# EAGLE design LTE Shield v2 (EAGLE 8.4.2)
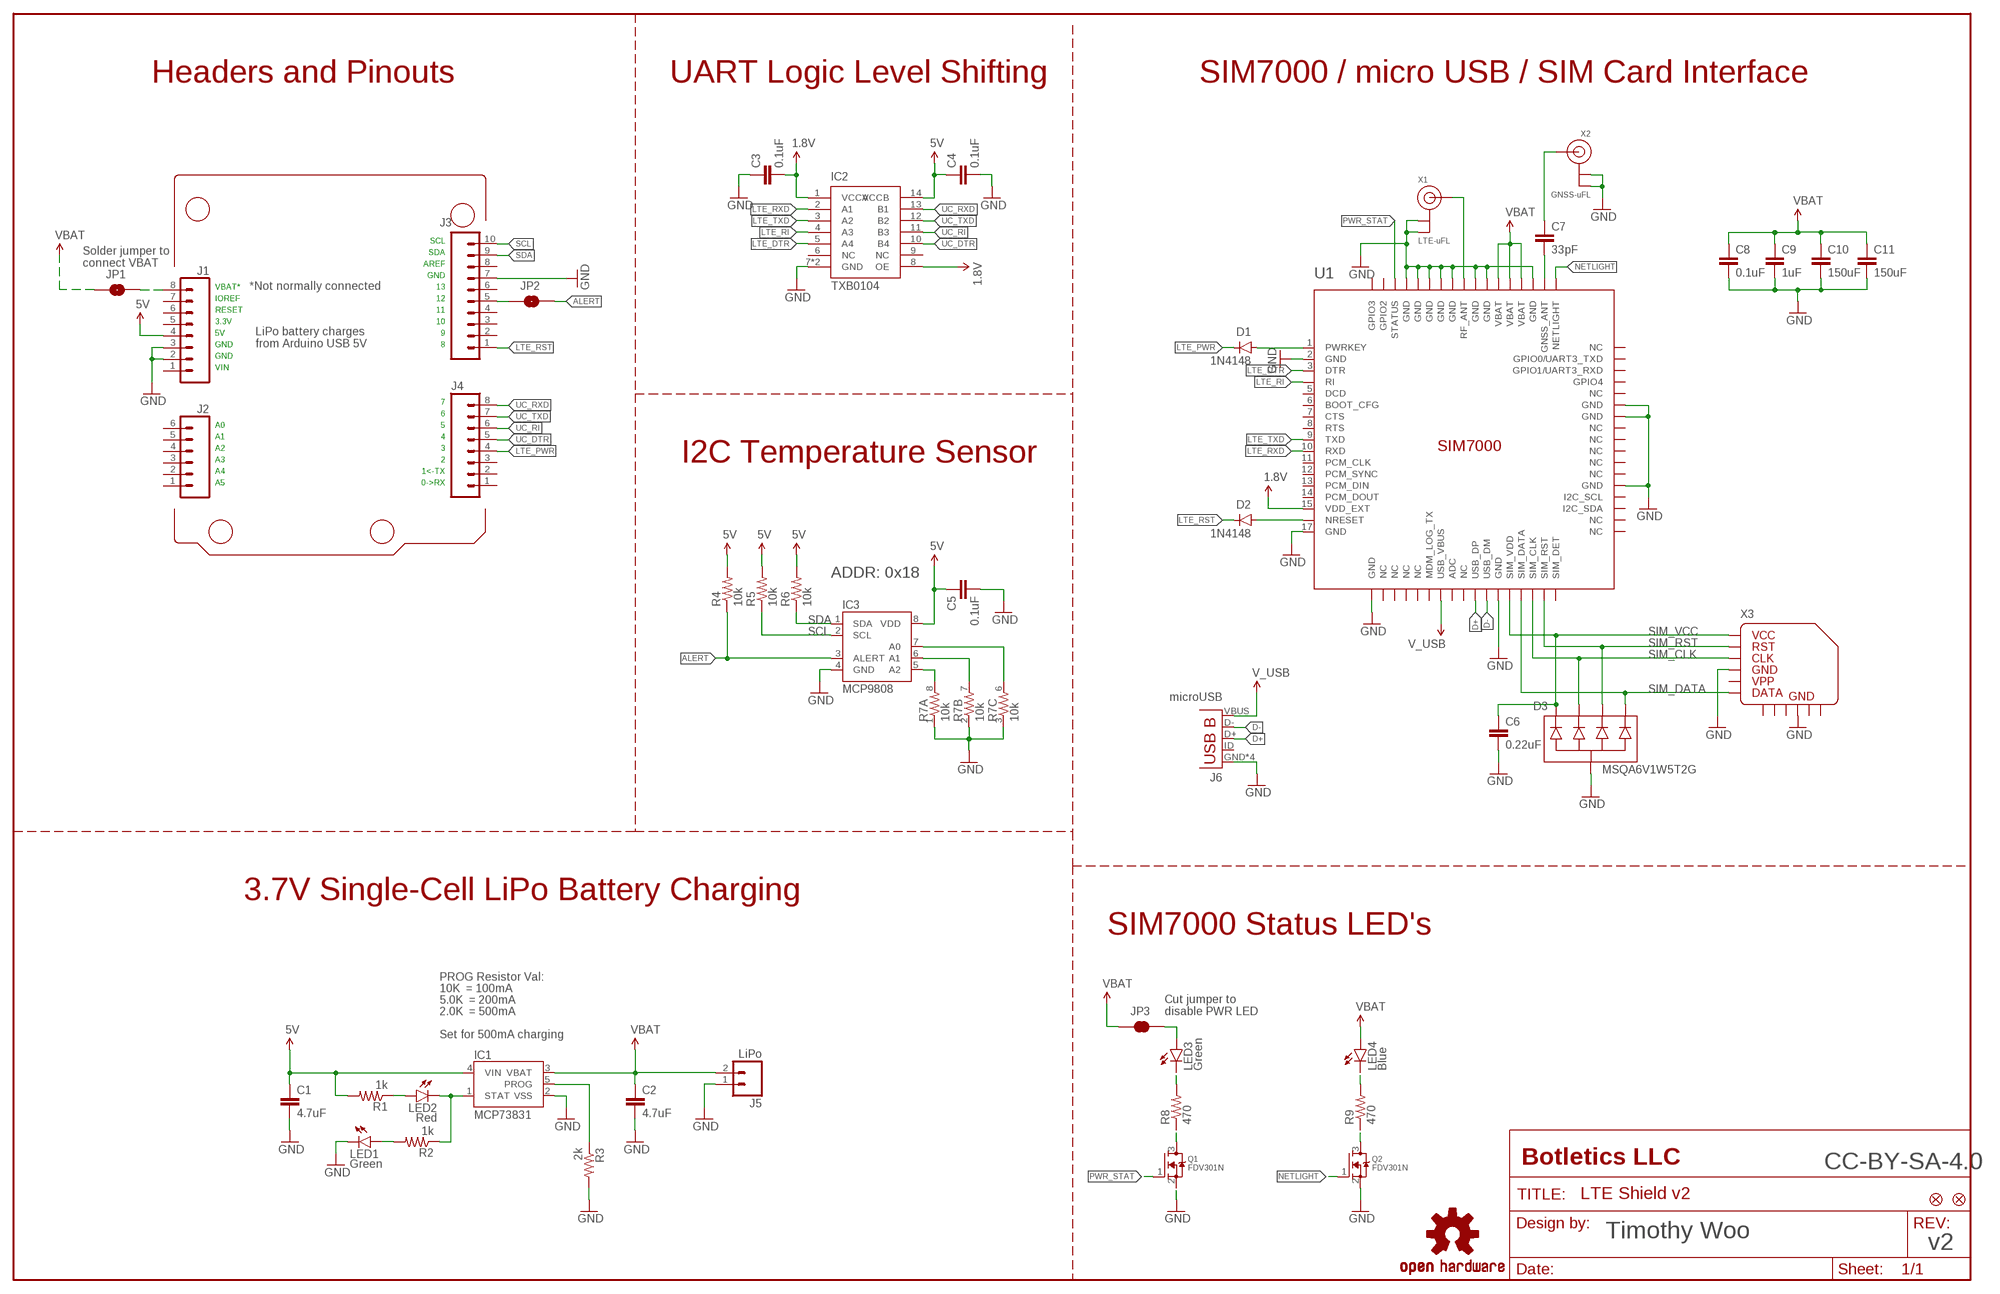
[diagram p0: schematic, sheet 1]

## Parts
C1  4.7uF  CAPMARKED-0603  [0603-CAP-MARKED]
C2  4.7uF  CAPMARKED-0603  [0603-CAP-MARKED]
C3  0.1uF  CAPMARKED-0603  [0603-CAP-MARKED]
C4  0.1uF  CAPMARKED-0603  [0603-CAP-MARKED]
C5  0.1uF  CAPMARKED-0603  [0603-CAP-MARKED]
C6  0.22uF  CAPMARKED-0603  [0603-CAP-MARKED]
C7  33pF  CAPMARKED-0603  [0603-CAP-MARKED]
C8  0.1uF  CAPMARKED-0603  [0603-CAP-MARKED]
C9  1uF  CAPMARKED-0603  [0603-CAP-MARKED]
C10  150uF  CAP1206  [1206]
C11  150uF  CAP1206  [1206]
D1  1N4148  DIODESOD323  [SOD-323]
D2  1N4148  DIODESOD323  [SOD-323]
D3  MSQA6V1W5T2G  TVS-DIODE-ARRAY-4X  [SOT-353]
FID1  FIDUCIAL  [FIDUCIAL_1MM]
FID2  FIDUCIAL  [FIDUCIAL_1MM]
IC1  MCP73831  [SOT23-5]
IC2  TXB0104  LEVEL_SHIFTER_TXB0104TXB0104RGYR  [VQFN-14]
IC3  MCP9808  MCP9808-MSOP  [8-TSSOP]
J1  M08SILK_PTH  [1X08]
J2  M06SILK_PTH  [1X06]
J3  M10SILK_PTH  [1X10]
J4  M08SILK_PTH  [1X08]
J5  LiPo  M02-JST-2MM-SMT  [JST-2-SMD]
J6  microUSB  MICRO-USB_SMD_NOSHIELDV1  [USB-B-MICRO-SMD]
JP1  JUMPER-SMT_2_NO_SILK  [SMT-JUMPER_2_NO_SILK]
JP2  JUMPER-SMT_2_NO_SILK  [SMT-JUMPER_2_NO_SILK]
JP3  JUMPER-SMT_2_NC_TRACE_SILK  [SMT-JUMPER_2_NC_TRACE_SILK]
LED1  Green  LED0603-MARKED  [LED-0603-MARKED]
LED2  Red  LED0603-MARKED  [LED-0603-MARKED]
LED3  Green  LED0603-MARKED  [LED-0603-MARKED]
LED4  Blue  LED0603-MARKED  [LED-0603-MARKED]
LOGO1  OSHW-LOGOL  [OSHW-LOGO-L]
Q1  FDV301N  MOSFET-NGENERIC  [SOT23-3]
Q2  FDV301N  MOSFET-NGENERIC  [SOT23-3]
R1  1k  RESISTORMARKED-0603  [0603-RES-MARKED]
R2  1k  RESISTORMARKED-0603  [0603-RES-MARKED]
R3  2k  RESISTORMARKED-0603  [0603-RES-MARKED]
R4  10k  RESISTORMARKED-0603  [0603-RES-MARKED]
R5  10k  RESISTORMARKED-0603  [0603-RES-MARKED]
R6  10k  RESISTORMARKED-0603  [0603-RES-MARKED]
R7  10k  RESISTOR_ARRAY_4X0603-ARV  [RES_ARRAY_4X0603]
R8  470  RESISTORMARKED-0603  [0603-RES-MARKED]
R9  470  RESISTORMARKED-0603  [0603-RES-MARKED]
U1  SIM7000  [SIM7000]
X1  LTE-uFL  ANTENNA_U.FL  [U.FL]
X2  GNSS-uFL  ANTENNA_U.FL  [U.FL]
X3  MICROSIM_SOCKET_PUSH-PULL  [MICROSIM_SOCKET_PUSH-PULL]

## Nets
1.8V: C3.2 IC2.1(VCCA) IC2.8(OE) U1.15(VDD_EXT)
5V: C1.1 C4.1 C5.1 IC1.4(VIN) IC2.14(VCCB) IC3.8(VDD) J1.4 R1.2 R4.2 R5.2 R6.2
ADDR0: IC3.7(A0) R7.6
ADDR1: IC3.6(A1) R7.7
ADDR2: IC3.5(A2) R7.8
ALERT: IC3.3(ALERT) JP2.2 R4.1
D+: J6.D+ U1.27(USB_DP)
D-: J6.D- U1.28(USB_DM)
GND: C1.2 C2.2 C3.1 C4.2 C5.2 C6.2 C8.2 C9.2 C10.2 C11.2 D3.2(COM) IC1.2(VSS) IC2.7(GND) IC2.PAD(GND) IC3.4(GND) J1.2 J1.3 J3.7 J5.1 J6.GND J6.SHIELD1(GND) J6.SHIELD2(GND) J6.SHIELD3(GND) LED1.C Q1.2(S) Q2.2(S) R3.2 R7.1 R7.2 R7.3 U1.2(GND) U1.17(GND) U1.18(GND) U1.29(GND) U1.39(GND) U1.45(GND) U1.46(GND) U1.54(GND) U1.58(GND) U1.59(GND) U1.61(GND) U1.62(GND) U1.63(GND) U1.64(GND) U1.65(GND) X1.1(GND) X1.2(GND) X2.1(GND) X2.2(GND) X3.C5 X3.GND@4(GND)
LTE_DTR: IC2.5(A4) U1.3(DTR)
LTE_PWR: D1.C J4.4
LTE_RI: IC2.4(A3) U1.4(RI)
LTE_RST: D2.C J3.1
LTE_RXD: IC2.2(A1) U1.10(RXD)
LTE_TXD: IC2.3(A2) U1.9(TXD)
N$1: C7.2 U1.53(GNSS_ANT)
N$2: D1.A U1.1(PWRKEY)
N$3: C7.1 X2.3(SIGNAL)
N$4: Q1.3(D) R8.1
N$5: LED3.C R8.2
N$6: LED2.A R1.1
N$7: J3.5 JP2.1
N$8: LED1.A R2.2
N$9: J1.8 JP1.2
N$10: Q2.3(D) R9.1
N$11: LED4.C R9.2
N$12: JP3.2 LED3.A
NETLIGHT: Q2.1(G) U1.52(NETLIGHT)
NRESET: D2.A U1.16(NRESET)
PROG: IC1.5(PROG) R3.1
PWR_STAT: Q1.1(G) U1.66(STATUS)
RF_ANT: U1.60(RF_ANT) X1.3(SIGNAL)
SCL: IC3.2(SCL) J3.10 R5.1
SDA: IC3.1(SDA) J3.9 R6.1
SIM_CLK: D3.3 U1.32(SIM_CLK) X3.C3
SIM_DATA: D3.5 U1.31(SIM_DATA) X3.C7
SIM_RST: D3.4 U1.33(SIM_RST) X3.C2
SIM_VCC: C6.1 D3.1 U1.30(SIM_VDD) X3.C1
STAT: IC1.1(STAT) LED2.C R2.1
UC_DTR: IC2.10(B4) J4.5
UC_RI: IC2.11(B3) J4.6
UC_RXD: IC2.13(B1) J4.8
UC_TXD: IC2.12(B2) J4.7
V_USB: J6.VBUS U1.24(USB_VBUS)
VBAT: C2.1 C8.1 C9.1 C10.1 C11.1 IC1.3(VBAT) J5.2 JP1.1 JP3.1 LED4.A U1.55(VBAT) U1.56(VBAT) U1.57(VBAT)
Unconnected: IC2.6(NC) IC2.9(NC) J1.1 J1.5 J1.6 J1.7 J2.1 J2.2 J2.3 J2.4 J2.5 J2.6 J3.2 J3.3 J3.4 J3.6 J3.8 J4.1 J4.2 J4.3 J6.ID(USBID) R7.4 R7.5 U1.5(DCD) U1.6(BOOT_CFG) U1.7(CTS) U1.8(RTS) U1.11(PCM_CLK) U1.12(PCM_SYNC) U1.13(PCM_DIN) U1.14(PCM_DOUT) U1.19(NC) U1.20(NC) U1.21(NC) U1.22(NC) U1.23(MDM_LOG_TX) U1.25(ADC) U1.26(NC) U1.34(SIM_DET) U1.35(NC) U1.36(NC) U1.37(I2C_SDA) U1.38(I2C_SCL) U1.40(NC) U1.41(NC) U1.42(NC) U1.43(NC) U1.44(NC) U1.47(NC) U1.48(GPIO4) U1.49(GPIO1/UART3_RXD) U1.50(GPIO0/UART3_TXD) U1.51(NC) U1.67(GPIO2) U1.68(GPIO3) X3.C6

## Notes on the sheet
- Headers and Pinouts | UART Logic Level Shifting | SIM7000 / micro USB / SIM Card Interface
- SCL
- SDA
- Solder jumper to
  connect VBAT
- AREF
- GND
- VBAT* | *Not normally connected | 13
- IOREF | 12
- RESET | 11
- 3.3V | 10
- 5V | 9
- GND
- LiPo battery charges
  from Arduino USB 5V
- 8
- GND
- VIN
- 7
- 6
- A0 | 5
- A1 | 4
- A2 | 3
- A3 | 2 | I2C Temperature Sensor
- A4 | 1<-TX
- A5 | 0->RX
- ADDR: 0x18
- 3.7V Single-Cell LiPo Battery Charging
- SIM7000 Status LED's
- PROG Resistor Val:
- 10K  = 100mA
- 5.0K  = 200mA
- 2.0K  = 500mA
- Cut jumper to
  disable PWR LED
- Set for 500mA charging
- CC-BY-SA-4.0
- Timothy Woo
- v2

## Power pins joined to a net without a drawn wire
GND: X3.GND@1(GND) X3.GND@2(GND) X3.GND@3(GND) X3.GND@5(GND) X3.GND@6(GND)

## Library data of the parts
C1-C11 = TimWoo-Capacitors:CAP: Capacitor Standard 0603 ceramic capacitor, and 0.1" leaded capacitor.
D1 D2 = TimWoo-Diodes:DIODE: Diode These are standard reverse protection diodes and small signal diodes. SMA package can handle up to about 1A. SOD-323 can handle about 200mA. What the SOD-323 package when ordering, there are some mfgs out there that are 5-pin packages.; PROD_ID: DIO-09646; VALUE: 250mA/100V
D3 = TimWoo-Diodes:TVS-DIODE-ARRAY-4X
FID1 FID2 = TimWoo-Aesthetics:FIDUCIAL: Fiducial Alignment Points Various fiducial points for machine vision alignment.
IC1 = TimWoo-IC:MCP73831: Miniature single cell, fully integrated Li-Ion, Li-polymer charge management controller http://ww1.microchip.com/downloads/en/DeviceDoc/20001984g.pdf IC-09995; PROD_ID: IC-09995
IC2 = TimWoo-IC:LEVEL_SHIFTER_TXB0104
IC3 = TimWoo-IC:MCP9808
J1 J4 = TimWoo-Connectors:M08: Header 8 Standard 8-pin 0.1" header. Use with straight break away headers (SKU : PRT-00116), right angle break away headers (PRT-00553), swiss pins (PRT-00743), machine pins (PRT-00117), and female headers (PRT-00115).; PROD_ID: CONN-08438
J2 = TimWoo-Connectors:M06: Header 6 Standard 6-pin 0.1" header. Use with straight break away headers (SKU : PRT-00116), right angle break away headers (PRT-00553), swiss pins (PRT-00743), machine pins (PRT-00117), and female headers (PRT-00115). Molex polarized connector foot print use with SKU : PRT-08094 with associated crimp pins and housings. NOTES ON THE VARIANTS LOCK and LOCK_LONGPADS... This footprint was designed to help hold the alignment of a through-hole component (i.e. 6-pin header) while soldering it into place. You may notice that each hole has been shifted either up or down by 0.005 of an inch from it's more standard position (which is a perfectly straight line). This slight alteration caused the pins (the squares in the middle) to touch the edges of the holes. Because they are alternating, it causes a "brace" to hold the component in place. 0.005 has proven to be the perfect amount of "off-center" position when using our standard breakaway headers. Although looks a little odd when you look at the bare footprint, once you have a header in there, the alteration is very hard to notice. Also,if you push a header all the way into place, it is covered up entirely on the bottom side. This idea of altering the position of holes to aid alignment will be further integrated into the Sparkfun Library for other footprints. It can help hold any component with 3 or more connection pins.; PROD_ID: CONN-08437
J3 = TimWoo-Connectors:M10: Header 10 Standard 10-pin 0.1" header. Use with straight break away headers (SKU : PRT-00116), right angle break away headers (PRT-00553), swiss pins (PRT-00743), machine pins (PRT-00117), and female headers (PRT-00115).; PROD_ID: CONN-11563
J5 = TimWoo-Connectors:M02: Standard 2-pin 0.1" header. Use with - straight break away headers ( PRT-00116) - right angle break away headers (PRT-00553) - swiss pins (PRT-00743) - machine pins (PRT-00117) - female headers (PRT-00115) Molex polarized connector foot print use with: PRT-08233 with associated crimp pins and housings. 2.54_SCREWTERM for use with PRT-10571. 3.5mm Screw Terminal footprints for PRT-08084 5mm Screw Terminal footprints for use with PRT-08432; PROD_ID: CONN-11443
J6 = TimWoo-Connectors:MICRO-USB_SMD_NOSHIELD
JP1 JP2 = TimWoo-Connectors:JUMPER-SMT_2_NO: Normally open jumper This jumper has two pads in close proximity to each other. Apply solder to close the connection. Round pads are easier to solder for beginners, but are a lot larger. SparkFun Product that uses the round pads: SparkFun EL Sequencer <https://www.sparkfun.com/products/12781>
JP3 = TimWoo-Connectors:JUMPER-SMT_2_NC_TRACE: Normally closed trace jumper This jumper has a trace between two pads so it's normally closed (NC). Use a razor knife to open the connection. For best results follow the IPC guidelines for cutting traces: Cutout at least 0.063 mm (0.005 in). Remove all loose material to clean up the cut area. Seal the cut with an approved epoxy. Reapply solder to reclose the connection.
LED1-LED4 = TimWoo-LED:LED: LEDs Standard schematic elements and footprints for 5mm, 3mm, 1206, and 0603 sized LEDs. 5mm - Spark Fun Electronics SKU : COM-00529 (and others)
LOGO1 = SparkFun-Aesthetics:OSHW-LOGO: Open-Source Hardware (OSHW) Logo This logo indicates the piece of hardware it is found on incorporates a OSHW license and/or adheres to the definition of open source hardware found here: http://freedomdefined.org/OSHW
Q1 Q2 = TimWoo-MOSFETs:MOSFET-N: N-Channel Mosfet DMG2302UK - 20V 2.8A SOT23 [Digikey: DMG2302UK-7DICT-ND] 2N7002E - 60V 260mA SOT23 [Digikey: 2N7002ET1GOSTR-ND] - REEL BSH103 - 30V 850mA SOT23 [Digikey: 568-5013-1-ND]
R1-R6 R8 R9 = TimWoo-Resistors:RESISTOR: Resistor Basic schematic elements and footprints for 0603, 1206, and PTH resistors.
R7 = TimWoo-Resistors:RESISTOR_ARRAY_4X: Array Chip Resistor Source: RS Component / Phycomp
U1 = TimWoo-RF:SIM7000
X1 X2 = adafruit:ANTENNA_U.FL: U.FL Antenna Connector
X3 = TimWoo-Connectors:MICROSIM_SOCKET_PUSH-PULL: https://www.digikey.com/product-detail/en/molex-llc/0786463001/WM9364CT-ND/3770350

## Net classes
0 default: width 0.305 mm
1 power: width 0.406 mm

## Board
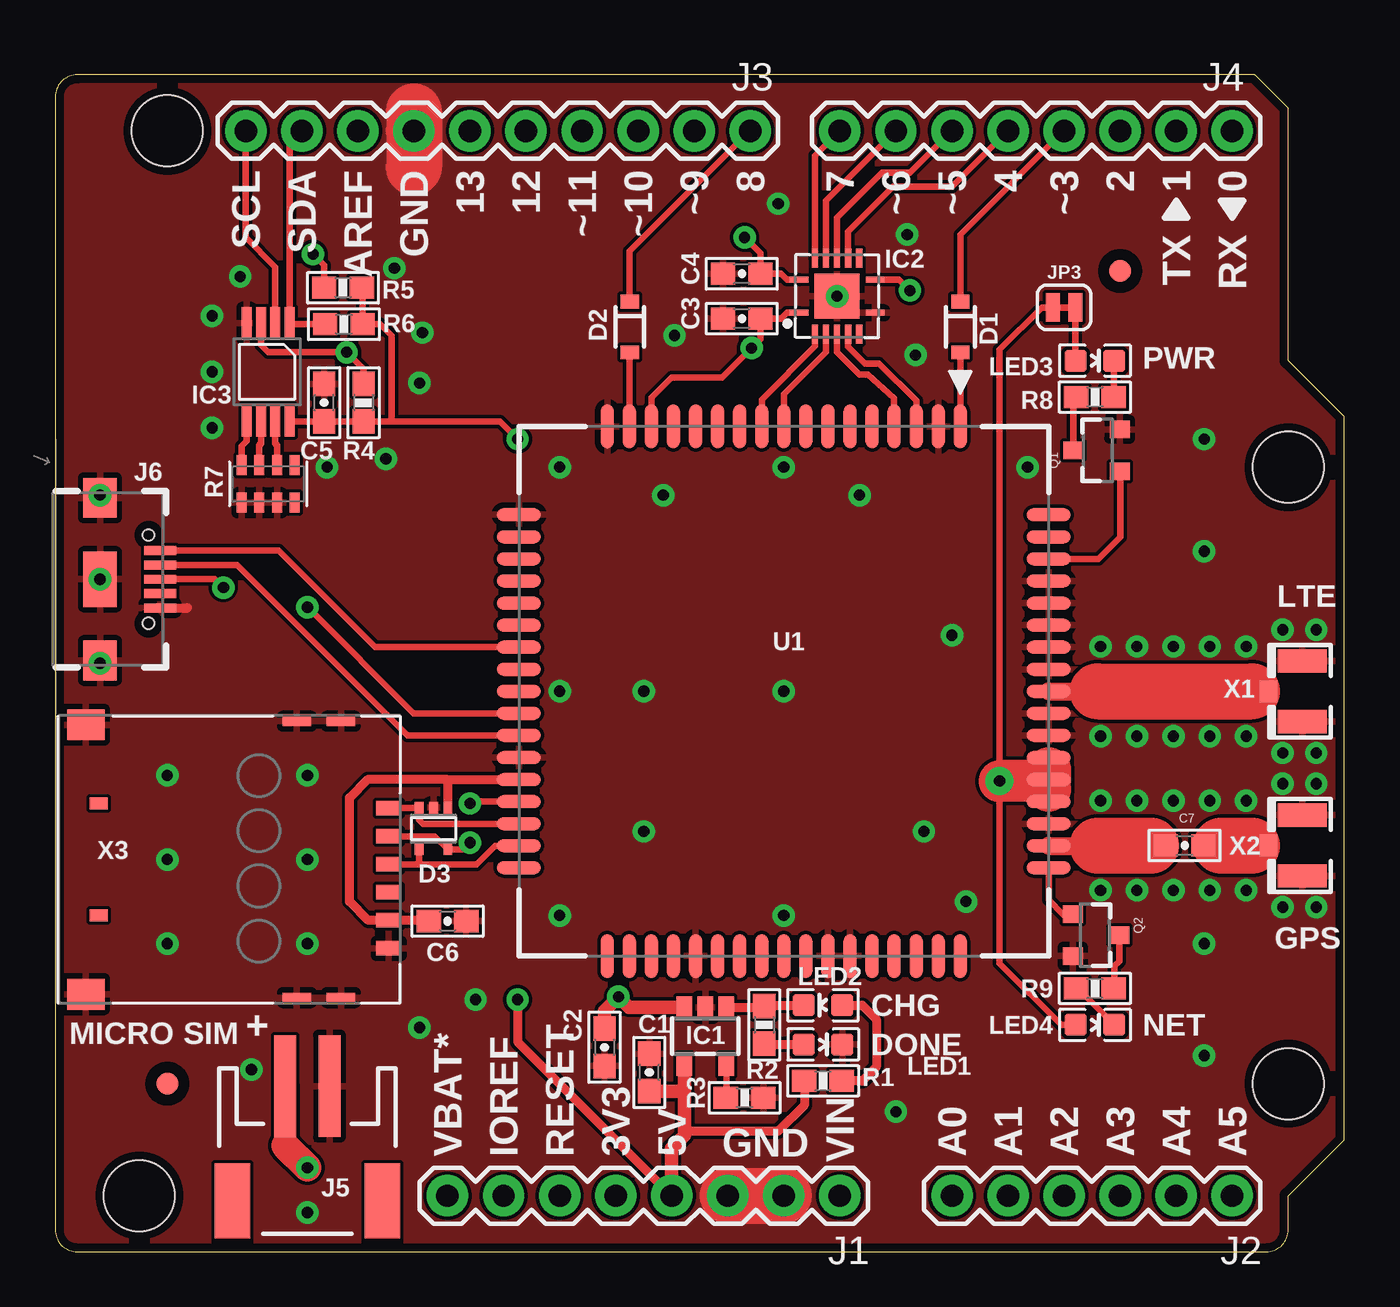
[diagram p1: board, top side]
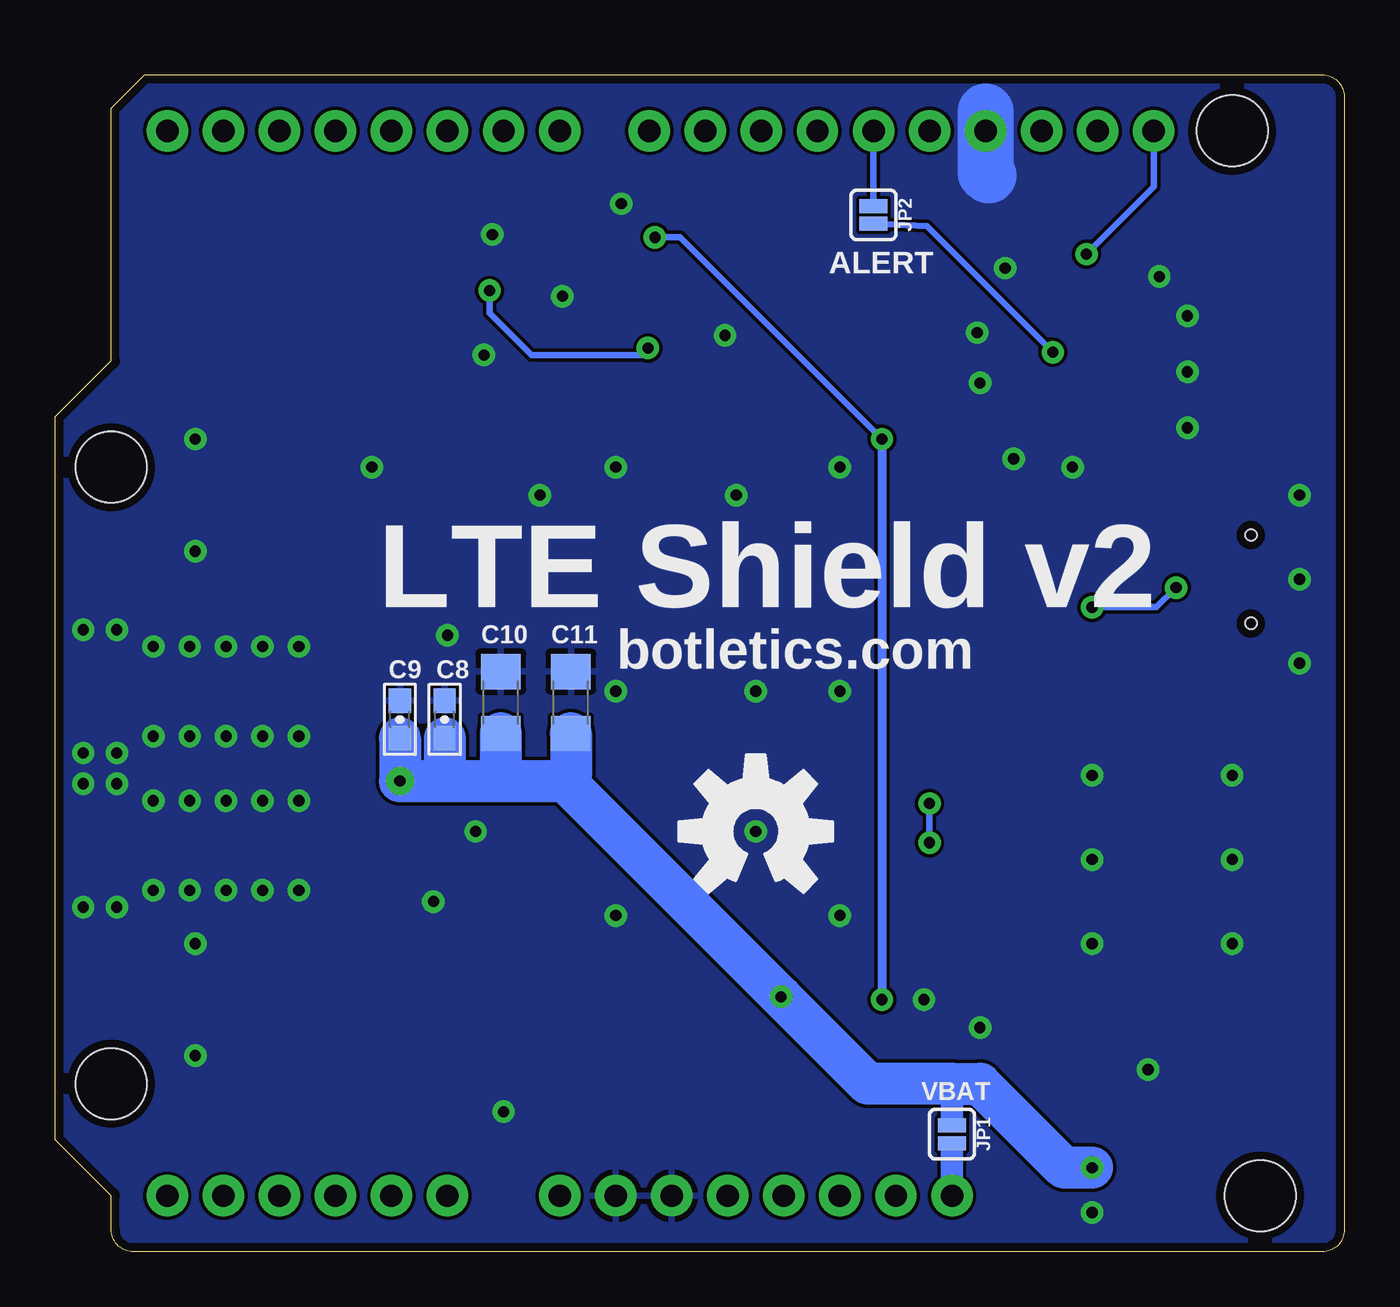
[diagram p2: board, bottom side, seen from below]

Size 58.42 x 53.34 mm. Coordinates in mm from the lower left corner, seen from the top.
Outline: 0,52.34 0,1 arc90 1,0 54.88,0 arc90 55.88,1 55.88,2.54 58.42,5.08 58.42,37.85 55.88,40.39 55.88,51.82 54.36,53.34 1,53.34 arc90 0,52.34
Copper layers (1*16): Top 0.0356mm / dielectric 1.5011mm / Bottom 0.0356mm
Design rules "oshpark-2layer *": minimum track width 6mil, minimum drill 13mil, track to track 6mil, track to pad 6mil, pad to pad 6mil, via to via 6mil, smd to smd 6mil, copper to edge 15mil, drill to drill 6mil, minimum pad ring 7mil, minimum via ring 7mil, stop-mask expansion 2.5mil, vias tented up to drill 0mil, thermal gap 10mil
Holes 3.2 mm at 3.81,2.54 5.08,50.8 55.88,35.56 55.88,7.62

### Footprints (pad centres in the part's own frame; a part is rotated, then mirrored left to right if it is on the bottom)
0603-CAP-MARKED = smd 1.1 x 1: 1 -0.85,0; 2 0.85,0
1206 = smd 1.6 x 1.8: 1 -1.4,0; 2 1.4,0
SOD-323 = smd 0.63 x 0.83: A 1.15,0; C -1.15,0
SOT-353 = smd 0.4 x 0.5: 1 -0.65,-0.95; 2 0,-0.95; 3 0.65,-0.95; 4 0.65,0.95; 5 -0.65,0.95
FIDUCIAL_1MM = smd 1 x 1: 1 0,0
SOT23-5 = smd 0.7 x 1: 1 -0.95,-1.3; 2 0,-1.3; 3 0.95,-1.3; 4 0.95,1.3; 5 -0.95,1.3
VQFN-14 = smd 0.85 x 0.28: 1 -1.725,-0.75; 7 1.725,-0.75; 8 1.725,0.75; 14 -1.725,0.75 | smd 0.28 x 0.85: 2 -1,-1.725; 3 -0.5,-1.725; 4 0,-1.725; 5 0.5,-1.725; 6 1,-1.725; 9 1,1.725; 10 0.5,1.725; 11 0,1.725; 12 -0.5,1.725; 13 -1,1.725 | smd 2.05 x 2.05: PAD 0,0
8-TSSOP = smd 0.45 x 1.45: 1 -0.975,-2.2; 2 -0.325,-2.2; 3 0.325,-2.2; 4 0.975,-2.2; 5 0.975,2.2; 6 0.325,2.2; 7 -0.325,2.2; 8 -0.975,2.2
1X08 = drill 1.016 pad 1.88: 1 -8.89,0; 2 -6.35,0; 3 -3.81,0; 4 -1.27,0; 5 1.27,0; 6 3.81,0; 7 6.35,0; 8 8.89,0
1X06 = drill 1.016 pad 1.88: 1 -6.35,0; 2 -3.81,0; 3 -1.27,0; 4 1.27,0; 5 3.81,0; 6 6.35,0
1X10 = drill 1.016 pad 1.88: 1 -11.43,0; 2 -8.89,0; 3 -6.35,0; 4 -3.81,0; 5 -1.27,0; 6 1.27,0; 7 3.81,0; 8 6.35,0; 9 8.89,0; 10 11.43,0
JST-2-SMD = smd 1 x 4.6: 1 -1,-3.7; 2 1,-3.7 | smd 1.6 x 3.4: NC1 -3.4,1.5; NC2 3.4,1.5
USB-B-MICRO-SMD = smd 1.45 x 0.4: D+ 2.725,0; D- 2.725,0.65; GND 2.725,-1.3; ID 2.725,-0.65; VBUS 2.725,1.3 | smd 1.5 x 1.8: SHIELD1 0,3.685; SHIELD2 0,-3.685 | smd 1.5 x 2.5: SHIELD3 0,0 | hole 0.5: 2.2,2; 2.2,-2
SMT-JUMPER_2_NO_SILK = smd 0.635 x 1.27: 1 -0.406,0; 2 0.406,0
SMT-JUMPER_2_NC_TRACE_SILK = smd 0.635 x 1.27: 1 -0.508,0; 2 0.508,0
LED-0603-MARKED = smd 1 x 1: A -0.877,0; C 0.877,0
SOT23-3 = smd 0.8 x 0.9: 1 -0.95,-1; 2 0.95,-1; 3 0,1.1
0603-RES-MARKED = smd 1.1 x 1: 1 -0.85,0; 2 0.85,0
RES_ARRAY_4X0603 = smd 0.45 x 0.9: 1 -1.2,-0.85; 2 -0.4,-0.85; 3 0.4,-0.85; 4 1.2,-0.85; 5 1.2,0.85; 6 0.4,0.85; 7 -0.4,0.85; 8 -1.2,0.85
SIM7000 = smd 2 x 0.6: 1 -12,8; 2 -12,7; 3 -12,6; 4 -12,5; 5 -12,4; 6 -12,3; 7 -12,2; 8 -12,1; 9 -12,0; 10 -12,-1; 11 -12,-2; 12 -12,-3; 13 -12,-4; 14 -12,-5; 15 -12,-6; 16 -12,-7; 17 -12,-8; 35 12,-8; 36 12,-7; 37 12,-6; 38 12,-5; 39 12,-4; 40 12,-3; 41 12,-2; 42 12,-1; 43 12,0; 44 12,1; 45 12,2; 46 12,3; 47 12,4; 48 12,5; 49 12,6; 50 12,7; 51 12,8 | smd 0.6 x 2: 18 -8,-12; 19 -7,-12; 20 -6,-12; 21 -5,-12; 22 -4,-12; 23 -3,-12; 24 -2,-12; 25 -1,-12; 26 0,-12; 27 1,-12; 28 2,-12; 29 3,-12; 30 4,-12; 31 5,-12; 32 6,-12; 33 7,-12; 34 8,-12; 52 8,12; 53 7,12; 54 6,12; 55 5,12; 56 4,12; 57 3,12; 58 2,12; 59 1,12; 60 0,12; 61 -1,12; 62 -2,12; 63 -3,12; 64 -4,12; 65 -5,12; 66 -6,12; 67 -7,12; 68 -8,12
U.FL = smd 2.2 x 1.05: 1 0,1.375; 2 0,-1.375 | smd 0.8 x 1: 3 1.525,0
MICROSIM_SOCKET_PUSH-PULL = smd 1.15 x 0.65: C1 -6.865,2.755; C2 -6.865,0.215; C3 -6.865,-2.325; C5 -6.865,4.025; C6 -6.865,1.485; C7 -6.865,-1.055 | smd 1.3 x 0.45: GND@1 -4.695,6.27; GND@2 -2.695,6.27; GND@3 -4.695,-6.27; GND@4 -2.695,-6.27 | smd 1.7 x 1.4: GND@5 6.865,6.105; GND@6 6.865,-6.105 | smd 0.8 x 0.54: X1 6.285,2.54; X2 6.285,-2.54

### Placement (x,y rotation side)
C1  26.92,8.13 90 top
C2  24.89,9.27 270 top
C3  31.11,42.29 0 top
C4  31.11,44.32 180 top
C5  12.19,38.48 90 top
C6  17.78,14.99 0 top
C7  51.18,18.41 180 top
C8  40.77,24.13 90 bottom
C9  42.8,24.13 90 bottom
C10  38.23,24.89 90 bottom
C11  35.05,24.89 90 bottom
D1  41.02,41.91 270 top
D2  26.04,41.91 270 top
D3  17.14,19.18 180 top
FID1  48.26,44.45 0 top
FID2  5.08,7.62 0 top
IC1  29.46,9.78 180 top
IC2  35.43,43.31 0 top
IC3  9.65,39.88 180 top
J1  26.67,2.54 180 top
J2  46.99,2.54 180 top
J3  20.07,50.8 180 top
J4  44.45,50.8 180 top
J5  11.43,3.81 180 top
J6  2.03,30.48 0 top
JP1  17.78,5.33 270 bottom
JP2  21.34,46.99 270 bottom
JP3  45.72,42.8 180 top
LED1  34.8,9.4 0 top
LED2  34.8,11.18 180 top
LED3  47.12,40.39 0 top
LED4  47.12,10.29 0 top
LOGO1  26.67,19.05 0 bottom
Q1  47.24,36.32 90 top
Q2  47.12,14.35 270 top
R1  34.8,7.75 180 top
R2  32.13,10.29 270 top
R3  31.24,6.99 0 top
R4  13.97,38.48 270 top
R5  13.04,43.69 0 top
R6  13.08,42.04 0 top
R7  9.65,34.8 0 top
R8  47.12,38.73 0 top
R9  47.12,11.94 180 top
U1  33.02,25.4 270 top
X1  56.52,25.4 180 top
X2  56.52,18.41 180 top
X3  8.26,17.78 180 top

### Tracks (layer width: path | path; a pad name or v marks a point on that pad's centre or on a via)
1.8V  (via drill 0.51 pad 1.02)
  Top 0.305: IC2.1 33.16,42.56 32.89,42.29 C3.2 31.96,41.36 v31.56,40.96 30.23,39.62 27.94,39.62 27.02,38.7 U1.15 | IC2.8 38.24,44.06 v38.73,43.56
  Bottom 0.305: v38.73,43.56 38.73,42.55 36.83,40.64 31.88,40.64 v31.56,40.96
5V  (via drill 0.51 pad 1.02)
  Top 0.305: R5.2 13.93,43.65 R6.2 14.73,42.04 15.24,41.53 15.24,37.63 | R4.2 14.77,37.63 | v20.95,36.83 20.15,37.63 15.24,37.63 | 15.24,37.63 R4.2 | v31.24,45.97 31.96,45.25 C4.1 32.89,44.32 33.16,44.06 IC2.14 | IC3.8 10.67,37.63 C5.1 R4.2
  Top 0.406: R1.2 33.95,6.64 32.77,5.46 28.64,5.46 28.51,5.59 | v20.95,11.43 20.95,9.53 J1.4
  Top 0.61: J1.4 27.94,4.7 28.51,5.27 28.51,5.59 28.51,7.24 | 28.51,7.24 IC1.4 | C1.1 28.48,7.28 28.51,7.24
  Bottom 0.305: v20.95,36.83 30.1,45.97 v31.24,45.97
  Bottom 0.406: v20.95,36.83 v20.95,11.43
ADDR0
  Top 0.305: IC3.7 9.98,36.63 10.05,36.56 R7.6
ADDR1
  Top 0.305: IC3.6 9.33,36.63 9.25,36.56 R7.7
ADDR2
  Top 0.305: IC3.5 8.68,36.74 8.45,36.52 R7.8
ALERT  (via drill 0.51 pad 1.02)
  Top 0.305: IC3.3 9.33,41.09 9.65,40.77 v13.21,40.77 13.97,40.01 R4.1
  Bottom 0.305: JP2.2 18.92,46.48 v13.21,40.77
D+  (via drill 0.51 pad 1.02)
  Top 0.305: U1.27 16.24,24.4 v11.43,29.21 | v7.62,30.1 7.24,30.48 J6.D+
  Bottom 0.305: v11.43,29.21 8.51,29.21 v7.62,30.1
D-
  Top 0.305: U1.28 15.97,23.4 8.24,31.13 J6.D-
GND  (via drill 0.51 pad 1.02)
  Top 0.406: J6.GND 6,29.18
  Top 2.54: 16.26,51.69 J3.7 16.26,49.15 | J1.3 J1.2
  Bottom 2.54: 16.26,51.69 J3.7 16.26,48.9 16.13,48.77
  other vias: 2.03,30.48 2.03,34.29 2.03,26.67 35.43,43.31 57.15,21.21 55.63,21.21 55.63,22.61 57.15,22.61 55.63,15.62 57.15,15.62 55.63,28.19 57.15,28.19 53.98,16.38 53.98,20.45 52.32,20.45 52.32,16.38 53.98,27.43 53.98,23.37 50.67,27.43 52.32,23.37 7.11,42.42 7.11,39.88 7.11,37.34 8.38,44.2 14.99,35.94 16.51,39.37 12.32,35.56 49.02,27.43 47.37,27.43 50.67,23.37 47.37,23.37 49.02,23.37 50.67,20.45 49.02,20.45 47.37,20.45 50.67,16.38 49.02,16.38 47.37,16.38 15.37,44.58 16.64,41.66 41.27,15.88 22.86,15.24 22.86,35.56 26.67,19.05 39.37,19.05 44.07,35.56 26.67,25.4 33.02,15.24 33.02,35.56 22.86,25.4 33.02,25.4 5.08,17.78 5.08,21.59 5.08,13.97 11.43,21.59 11.43,17.78 11.43,13.97 11.43,1.78 8.89,8.26 28.07,41.53 38.99,40.64 38.61,46.1 32.77,47.5 19.05,11.43 16.51,10.16 38.1,6.35 52.32,27.43 27.56,34.29 36.45,34.29 40.64,27.94 52.07,31.75 52.07,36.83 52.07,13.97 52.07,8.89
  pour Top: -1.27,54.61 59.69,54.61 59.69,-1.27 -1.27,-1.27
  pour Bottom: -2.54,55.88 60.96,55.88 60.96,-2.54 -2.54,-2.54
LTE_DTR
  Top 0.305: U1.3 39.02,38.58 37.34,40.26 36.7,40.26 35.93,41.03 IC2.5
LTE_PWR
  Top 0.305: D1.C 41.02,46.1 J4.4
LTE_RI
  Top 0.305: U1.4 38.02,38.69 36.83,39.75 36.45,39.75 35.43,40.77 IC2.4
LTE_RST
  Top 0.305: J3.1 26.04,45.34 D2.C
LTE_RXD
  Top 0.305: IC2.2 34.43,41.04 32.02,38.62 U1.10
LTE_TXD
  Top 0.305: IC2.3 34.93,40.77 33.02,38.86 U1.9
N$1
  Top 0.813: 49.66,18.41 C7.2 | U1.53 47.23,18.4 47.24,18.41
  Top 2.54: 47.24,18.41 49.66,18.41
N$2
  Top 0.305: U1.1 D1.A
N$3
  Top 0.813: C7.1 52.83,18.41 | 54.23,18.41 X2.3
  Top 2.54: 52.83,18.41 54.23,18.41
N$4
  Top 0.305: Q1.3 46.14,38.61 R8.1
N$5
  Top 0.305: R8.2 47.97,40.36 LED3.C
N$6
  Top 0.406: LED2.A 36.58,11.18 37.21,10.54 37.21,8.38 36.58,7.75 R1.1
N$7
  Bottom 0.305: J3.5 JP2.1
N$8
  Top 0.406: R2.2 32.17,9.4 LED1.A
N$9
  Bottom 0.61: 17.78,4.7 JP1.2
  Bottom 1.016: J1.8 17.78,4.7
N$10
  Top 0.305: Q2.3 48.22,13.16 48.01,12.95 48.01,11.98 R9.1
N$11
  Top 0.305: R9.2 46.34,11.94 LED4.C
N$12
  Top 0.305: LED3.A 46.24,42.79 46.23,42.8
NETLIGHT
  Top 0.305: Q2.1 45.66,15.3 45.02,15.94 U1.52
NRESET
  Top 0.305: D2.A 26.02,40.74 U1.16
PROG
  Top 0.305: IC1.5 30.41,7.01 R3.1
PWR_STAT
  Top 0.305: U1.66 47.27,31.4 48.26,32.38 48.26,35.36 Q1.1
RF_ANT
  Top 0.813: U1.60 47.24,25.4 | 54.23,25.4 X1.3
  Top 2.54: 47.24,25.4 54.23,25.4
SCL  (via drill 0.51 pad 1.02)
  Top 0.305: IC3.2 9.98,44.63 8.64,45.97 J3.10 | R5.1 12.19,44.7 v11.68,45.21
  Bottom 0.305: v11.68,45.21 8.64,48.26 J3.10
SDA
  Top 0.305: R6.1 10.67,42.04 IC3.1 10.63,50.25 J3.9
SIM_CLK
  Top 0.305: U1.32 16.67,19.4 16.5,19.57 D3.3 16.47,20.11 X3.C3
SIM_DATA  (via drill 0.51 pad 1.02)
  Top 0.305: U1.31 18.88,20.4 v18.8,20.32 | X3.C7 17.19,18.84 D3.5 18.48,18.23 v18.8,18.54
  Bottom 0.305: v18.8,18.54 v18.8,20.32
SIM_RST
  Top 0.305: X3.C2 16.51,17.57 | D3.4 16.5,17.58 16.51,17.57 | U1.33 19.92,18.4 19.09,17.57 16.51,17.57
SIM_VCC
  Top 0.406: C6.1 16.89,15.03 X3.C1 14.19,15.03 13.34,15.88 13.34,20.57 14.16,21.4 17.78,21.4 | 17.78,21.4 U1.30 | D3.1 17.8,21.39 17.78,21.4
STAT
  Top 0.406: LED2.C 32.17,11.18 R2.1 32.07,11.08 IC1.1
UC_DTR
  Top 0.305: IC2.10 35.93,46.22 37.97,48.26 40.64,48.26 J4.5
UC_RI
  Top 0.305: IC2.11 35.43,46.86 37.47,48.9 38.73,48.9 J4.6
UC_RXD
  Top 0.305: IC2.13 34.43,49.67 J4.8
UC_TXD
  Top 0.305: IC2.12 34.93,47.63 J4.7
V_USB
  Top 0.305: J6.VBUS 10.13,31.78 14.51,27.4 U1.24
VBAT  (via drill 0.51 pad 1.02, 0.51 pad 1.27)
  Top 0.305: LED4.A 45.59,10.29 42.8,13.08 v42.8,21.34 42.8,40.89 44.7,42.8 JP3.1
  Top 0.508: 45.02,21.84 U1.57 | 45.02,20.95 U1.55
  Top 0.61: IC1.3 26,11.08 v25.53,11.56 24.89,10.92 C2.1
  Top 1.016: J5.2 10.43,4.81
  Top 1.27: 10.43,4.81 v11.43,3.81
  Top 1.905: 44.64,21.34 v42.8,21.34 | U1.56 45.02,20.95
  Top 2.032: U1.56 45.02,21.84 | 44.64,21.34 45.02,20.95
  Bottom 0.61: JP1.1 17.78,6.1
  Bottom 1.016: 17.78,6.1 17.78,7.62
  Bottom 1.27: 35.05,21.59 35.31,21.34 | 40.77,21.46 40.64,21.34
  Bottom 1.905: 38.1,21.34 35.31,21.34 v25.53,11.56 21.59,7.62 17.78,7.62 16.51,7.62 12.7,3.81 v11.43,3.81 | 38.1,21.34 40.64,21.34 v42.8,21.34 C9.1 | C11.1 35.05,21.59 | C10.1 38.23,21.46 38.1,21.34 | C8.1 40.77,21.46

### Text on the board
tPlace: SCL | SDA | AREF | GND | 13 | 12 | ~11 | ~10 | ~9 | 8 | 7 | ~6 | ~5 | 4 | ~3 | 2 | 1 | 0 | TX | RX | PWR | LTE | GPS | CHG | + | NET | MICRO SIM | DONE | VBAT* | IOREF | RESET | 3V3 | 5V | GND | VIN | A0 | A1 | A2 | A3 | A4 | A5
bPlace: ALERT | LTE Shield v2 | botletics.com | VBAT
tDocu: Designed by Timothy Woo / Released under CC-BY-SA-4.0 license